# EAGLE schematic alcometer (EAGLE 6.5.0)
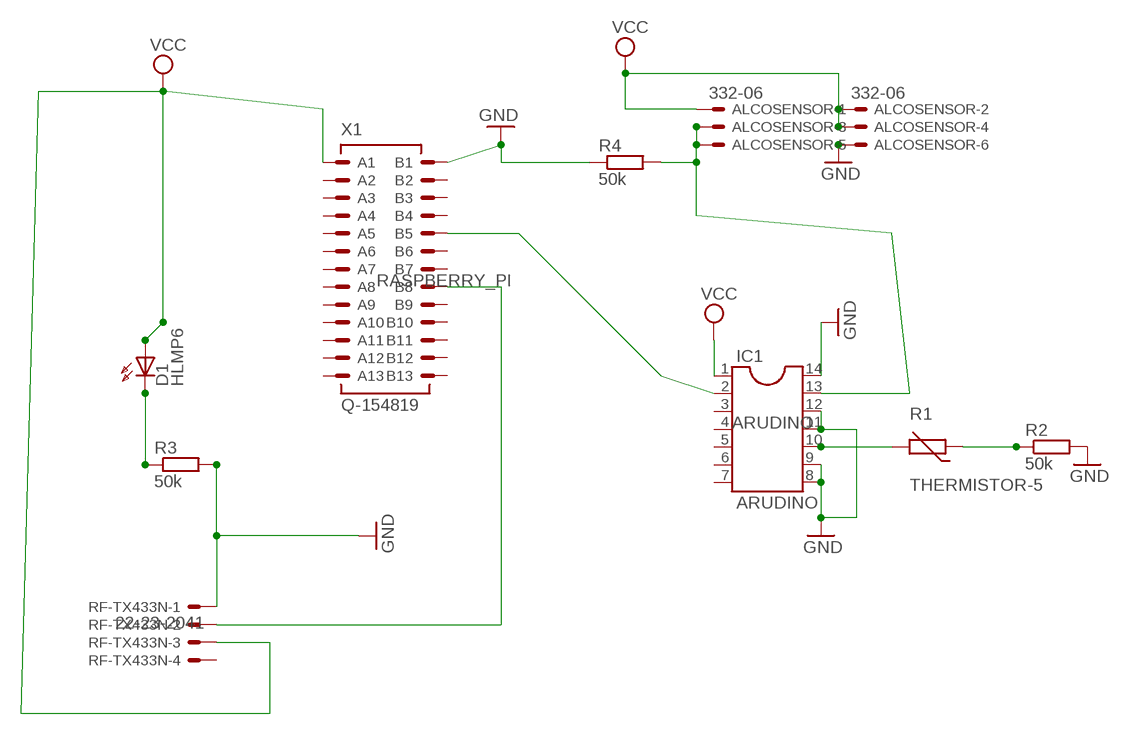
[diagram p0: schematic, sheet 1]

## Parts
ALCOSENSOR  332-06  [332-06]
D1  HLMP6  [HLMP6]
IC1  ARUDINO  DIL14  [DIL14]
R1  THERMISTOR-5  [R-5]
R2  50k  R-EU_0204/7  [0204/7]
R3  50k  R-EU_0204/7  [0204/7]
R4  50k  R-EU_0204/7  [0204/7]
RF-TX433N  22-23-2041  [22-23-2041]
X1  Q-154819  [154819]

## Nets
GND: ALCOSENSOR.6 IC1.8 IC1.9 IC1.11 IC1.12 IC1.14 R2.2 R3.2 R4.1 RF-TX433N.1 X1.B1
N$1: IC1.10 R1.2
N$2: IC1.2 X1.B5
N$3: R1.1 R2.1
N$4: RF-TX433N.2 X1.B8
N$5: D1.K R3.1
N$6: ALCOSENSOR.3 ALCOSENSOR.5 IC1.13 R4.2
VCC: ALCOSENSOR.1 ALCOSENSOR.2 ALCOSENSOR.4 D1.A IC1.1 RF-TX433N.3 X1.A1
Unconnected: IC1.3 IC1.4 IC1.5 IC1.6 IC1.7 RF-TX433N.4 X1.A2 X1.A3 X1.A4 X1.A5 X1.A6 X1.A7 X1.A8 X1.A9 X1.A10 X1.A11 X1.A12 X1.A13 X1.B2 X1.B3 X1.B4 X1.B6 X1.B7 X1.B9 X1.B10 X1.B11 X1.B12 X1.B13

## Library data of the parts
ALCOSENSOR = con-garry:332-06: 6 Pin - 2mm Dual Row Source: www.mpe-connector.de / garry_shortform_2012.pdf
D1 = display-hp:HLMP6: LED 2mm horizontal; MF: AGILENT TECHNOLOGIES; MPN: HLMP-6500; OC_FARNELL: 1652490; OC_NEWARK: 40K0088
IC1 = ic-package:DIL14: Dual In Line / Socket
R1 = varistor:THERMISTOR: THERMISTOR
R2-R4 = resistor:R-EU_: RESISTOR, European symbol
RF-TX433N = con-molex:22-23-2041: .100" (2.54mm) Center Header - 4 Pin; MF: MOLEX; MPN: 22-23-2041; OC_FARNELL: 1462920; OC_NEWARK: 38C0355
X1 = con-erni:Q-154819: Male Connector SMC-Q 26 contacts Type 7-13 - Low Profile Source: http://www.erni.com/DB/PDF-Drawing/SMC/154819.pdf; OC_FARNELL: unknown; OC_NEWARK: unknown